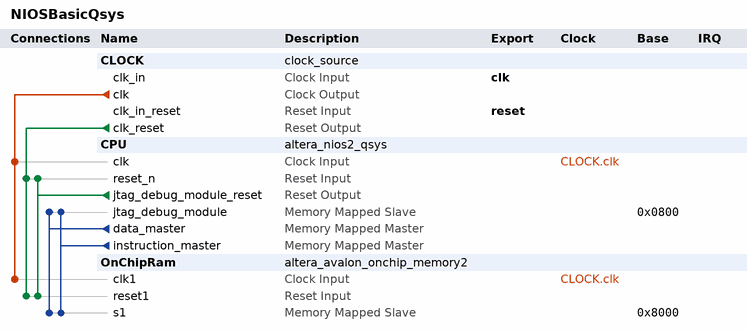
[diagram p0: system contents]
# Platform Designer (Qsys) system NIOSBasicQsys, Cyclone II EP2C35F672C6
# Parameters at their usual value, and those the tool derives, are not listed.
package require -exact qsys 13.0
create_system NIOSBasicQsys
set_project_property DEVICE_FAMILY {Cyclone II}
set_project_property DEVICE EP2C35F672C6

add_instance CLOCK clock_source 13.0
set_instance_parameter_value CLOCK clockFrequency 50000000

add_instance CPU altera_nios2_qsys 13.0
set_instance_parameter_value CPU muldiv_divider true
set_instance_parameter_value CPU resetSlave OnChipRam.s1
set_instance_parameter_value CPU mmu_TLBMissExcSlave None
set_instance_parameter_value CPU exceptionSlave OnChipRam.s1
set_instance_parameter_value CPU breakSlave CPU.jtag_debug_module
set_instance_parameter_value CPU impl Small
set_instance_parameter_value CPU icache_size 4096

add_instance OnChipRam altera_avalon_onchip_memory2 13.0.1.99.2
set_instance_parameter_value OnChipRam dataWidth 32
set_instance_parameter_value OnChipRam dualPort false
set_instance_parameter_value OnChipRam initMemContent true
set_instance_parameter_value OnChipRam initializationFileName onchip_mem.hex
set_instance_parameter_value OnChipRam memorySize 32768

# connections
add_connection CLOCK.clk CPU.clk clock
add_connection CLOCK.clk OnChipRam.clk1 clock
add_connection CLOCK.clk_reset CPU.reset_n reset
add_connection CLOCK.clk_reset OnChipRam.reset1 reset
add_connection CPU.jtag_debug_module_reset CPU.reset_n reset
add_connection CPU.jtag_debug_module_reset OnChipRam.reset1 reset
add_connection CPU.data_master CPU.jtag_debug_module avalon
set_connection_parameter_value CPU.data_master/CPU.jtag_debug_module baseAddress 0x0800
add_connection CPU.data_master OnChipRam.s1 avalon
set_connection_parameter_value CPU.data_master/OnChipRam.s1 baseAddress 0x8000
add_connection CPU.instruction_master CPU.jtag_debug_module avalon
set_connection_parameter_value CPU.instruction_master/CPU.jtag_debug_module baseAddress 0x0800
add_connection CPU.instruction_master OnChipRam.s1 avalon
set_connection_parameter_value CPU.instruction_master/OnChipRam.s1 baseAddress 0x8000

# exported interfaces
add_interface clk clock sink
set_interface_property clk EXPORT_OF CLOCK.clk_in
add_interface reset reset sink
set_interface_property reset EXPORT_OF CLOCK.clk_in_reset

set_interconnect_requirement {$system} qsys_mm.clockCrossingAdapter HANDSHAKE
set_interconnect_requirement {$system} qsys_mm.maxAdditionalLatency 1

save_system NIOSBasicQsys.qsys
